# EAGLE design CTD_bluetooth_revA (EAGLE 7.2.0)
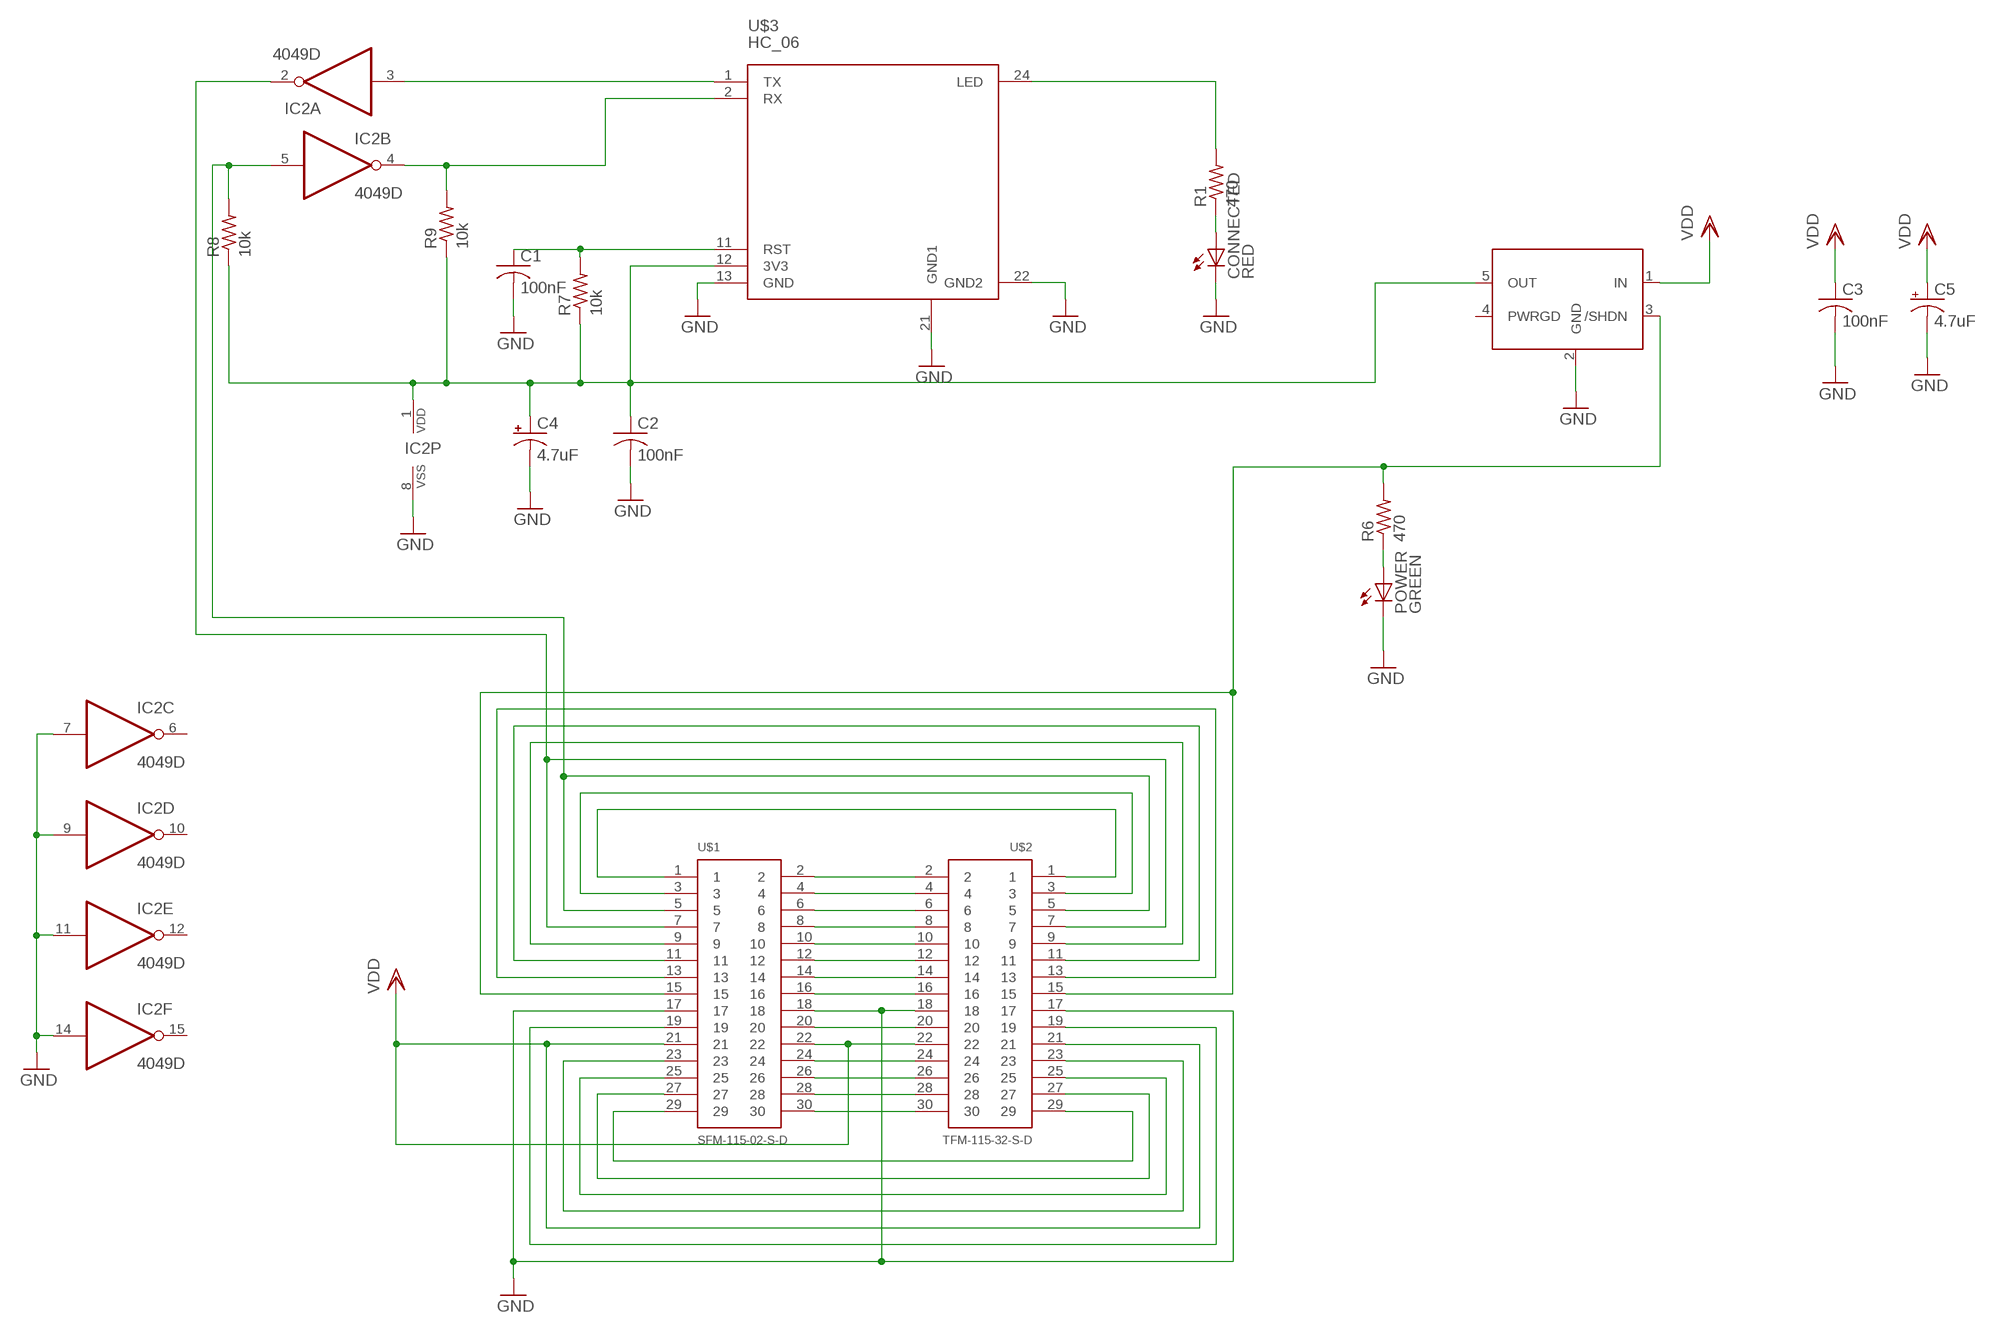
[diagram p0: schematic, sheet 1]

## Parts
C1  100nF  C-US050-024X044  [C050-024X044]
C2  100nF  C-US050-024X044  [C050-024X044]
C3  100nF  C-US050-024X044  [C050-024X044]
C4  4.7uF  CPOL-US153CLV-0505  [153CLV-0505]
C5  4.7uF  CPOL-US153CLV-0505  [153CLV-0505]
CONNECTED  RED  LEDSMT1206  [1206]
IC2  4049D  [SO16]
POWER  GREEN  LEDSMT1206  [1206]
R1  470  R-US_R5025  [R5025]
R6  470  R-US_R5025  [R5025]
R7  10k  R-US_R5025  [R5025]
R8  10k  R-US_R5025  [R5025]
R9  10k  R-US_R5025  [R5025]
U$1  SFM-115-02-S-D  [SFM-115-02-S-D]
U$2  TFM-115-32-S-D  [TFM-115-32-S-D]
U$3  HC_06  [BLUETOOTH_SMD_HC06]
U$4  MCP1755T  [SOT23-5]

## Nets
3V3: C2.1 C4.+ IC2.1(P:VDD) R7.1 R8.1 R9.1 U$3.12(3V3) U$4.5(OUT)
GND: C1.2 C2.2 C3.2 C4.- C5.- CONNECTED.C IC2.7(C:I) IC2.8(P:VSS) IC2.9(D:I) IC2.11(E:I) IC2.14(F:I) POWER.C U$1.17 U$1.18 U$2.17 U$2.18 U$3.13(GND) U$3.21(GND1) U$3.22(GND2) U$4.2(GND)
N$1: U$1.2 U$2.2
N$2: U$1.4 U$2.4
N$3: CONNECTED.A R1.1
N$4: U$1.6 U$2.6
N$5: U$1.10 U$2.10
N$6: U$1.12 U$2.12
N$7: U$1.14 U$2.14
N$8: U$1.8 U$2.8
N$9: U$1.16 U$2.16
N$10: U$1.20 U$2.20
N$11: POWER.A R6.1
N$12: U$1.24 U$2.24
N$13: U$1.26 U$2.26
N$14: U$1.28 U$2.28
N$15: U$1.30 U$2.30
N$16: U$1.1 U$2.1
N$17: U$1.3 U$2.3
N$20: U$1.9 U$2.9
N$21: U$1.11 U$2.11
N$22: U$1.13 U$2.13
N$24: U$1.29 U$2.29
N$25: U$1.27 U$2.27
N$26: U$1.25 U$2.25
N$27: U$1.23 U$2.23
N$29: U$1.19 U$2.19
N$34: R1.2 U$3.24(LED)
N$36: C1.1 R7.2 U$3.11(RST)
RX: IC2.5(B:I) R8.2 U$1.5 U$2.5
RXPRE: IC2.4(B:O) R9.2 U$3.2(RX)
SHUTDOWN: R6.2 U$1.15 U$2.15 U$4.3(/SHDN)
TX: IC2.2(A:O) U$1.7 U$2.7
TXPRE: IC2.3(A:I) U$3.1(TX)
VDD: C3.1 C5.+ U$1.21 U$1.22 U$2.21 U$2.22 U$4.1(IN)
Unconnected: IC2.6(C:O) IC2.10(D:O) IC2.12(E:O) IC2.15(F:O) U$4.4(PWRGD)

## Library data of the parts
C1-C3 = rcl:C-US: CAPACITOR, American symbol
C4 C5 = rcl:CPOL-US: POLARIZED CAPACITOR, American symbol
CONNECTED POWER = led:LED: LED OSRAM: - CHIPLED LG R971, LG N971, LY N971, LG Q971, LY Q971, LO R971, LY R971 LH N974, LH R974 LS Q976, LO Q976, LY Q976 LO Q996 - Hyper CHIPLED LW Q18S LB Q993, LB Q99A, LB R99A - SideLED LS A670, LO A670, LY A670, LG A670, LP A670 LB A673, LV A673, LT A673, LW A673 LH A674 LY A675 LS A676, LA A676, LO A676, LY A676, LW A676 LS A679, LY A679, LG A679 - Hyper Micro SIDELED® LS Y876, LA Y876, LO Y876, LY Y876 LT Y87S - SmartLED LW L88C, LW L88S LB L89C, LB L89S, LG L890 LS L89K, LO L89K, LY L89K LS L896, LA L896, LO L896, LY L896 - TOPLED LS T670, LO T670, LY T670, LG T670, LP T670 LSG T670, LSP T670, LSY T670, LOP T670, LYG T670 LG T671, LOG T671, LSG T671 LB T673, LV T673, LT T673, LW T673 LH T674 LS T676, LA T676, LO T676, LY T676, LB T676, LH T676, LSB T676, LW T676 LB T67C, LV T67C, LT T67C, LS T67K, LO T67K, LY T67K, LW E67C LS E67B, LA E67B, LO E67B, LY E67B, LB E67C, LV E67C, LT E67C LW T67C LS T679, LY T679, LG T679 LS T770, LO T770, LY T770, LG T770, LP T770 LB T773, LV T773, LT T773, LW T773 LH T774 LS E675, LA E675, LY E675, LS T675 LS T776, LA T776, LO T776, LY T776, LB T776 LHGB T686 LT T68C, LB T68C - Hyper Mini TOPLED® LB M676 - Mini TOPLED Santana® LG M470 LS M47K, LO M47K, LY M47K Source: http://www.osram.convergy.de LUXEON: - LUMILED® LXK2-PW12-R00, LXK2-PW12-S00, LXK2-PW14-U00, LXK2-PW14-V00 LXK2-PM12-R00, LXK2-PM12-S00, LXK2-PM14-U00 LXK2-PE12-Q00, LXK2-PE12-R00, LXK2-PE12-S00, LXK2-PE14-T00, LXK2-PE14-U00 LXK2-PB12-K00, LXK2-PB12-L00, LXK2-PB12-M00, LXK2-PB14-N00, LXK2-PB14-P00, LXK2-PB14-Q00 LXK2-PR12-L00, LXK2-PR12-M00, LXK2-PR14-Q00, LXK2-PR14-R00 LXK2-PD12-Q00, LXK2-PD12-R00, LXK2-PD12-S00 LXK2-PH12-R00, LXK2-PH12-S00 LXK2-PL12-P00, LXK2-PL12-Q00, LXK2-PL12-R00 Source: www.luxeon.com KINGBRIGHT: KA-3528ASYC Source: www.kingbright.com
IC2 = 40xx:4049: Hex inverting BUFFER
R1 R6-R9 = resistor:R-US_: RESISTOR, American symbol
U$1 = SFM-115-02-X-DH:SFM-115-02-S-D: SMT & THROUGH-HOLE TIGER EYE™ SOCKET SFM, SFML SERIES
U$2 = TFM-115-32-S-D:TFM-115-32-S-D: TFM, TFML SERIES SMT & THROUGH-HOLE HEADER
U$3 = SerialPortBluetooth:HC_06: HC-06 Bluetooth Module. Slave.
U$4 = microchip-vreg:MCP1755T

## Board
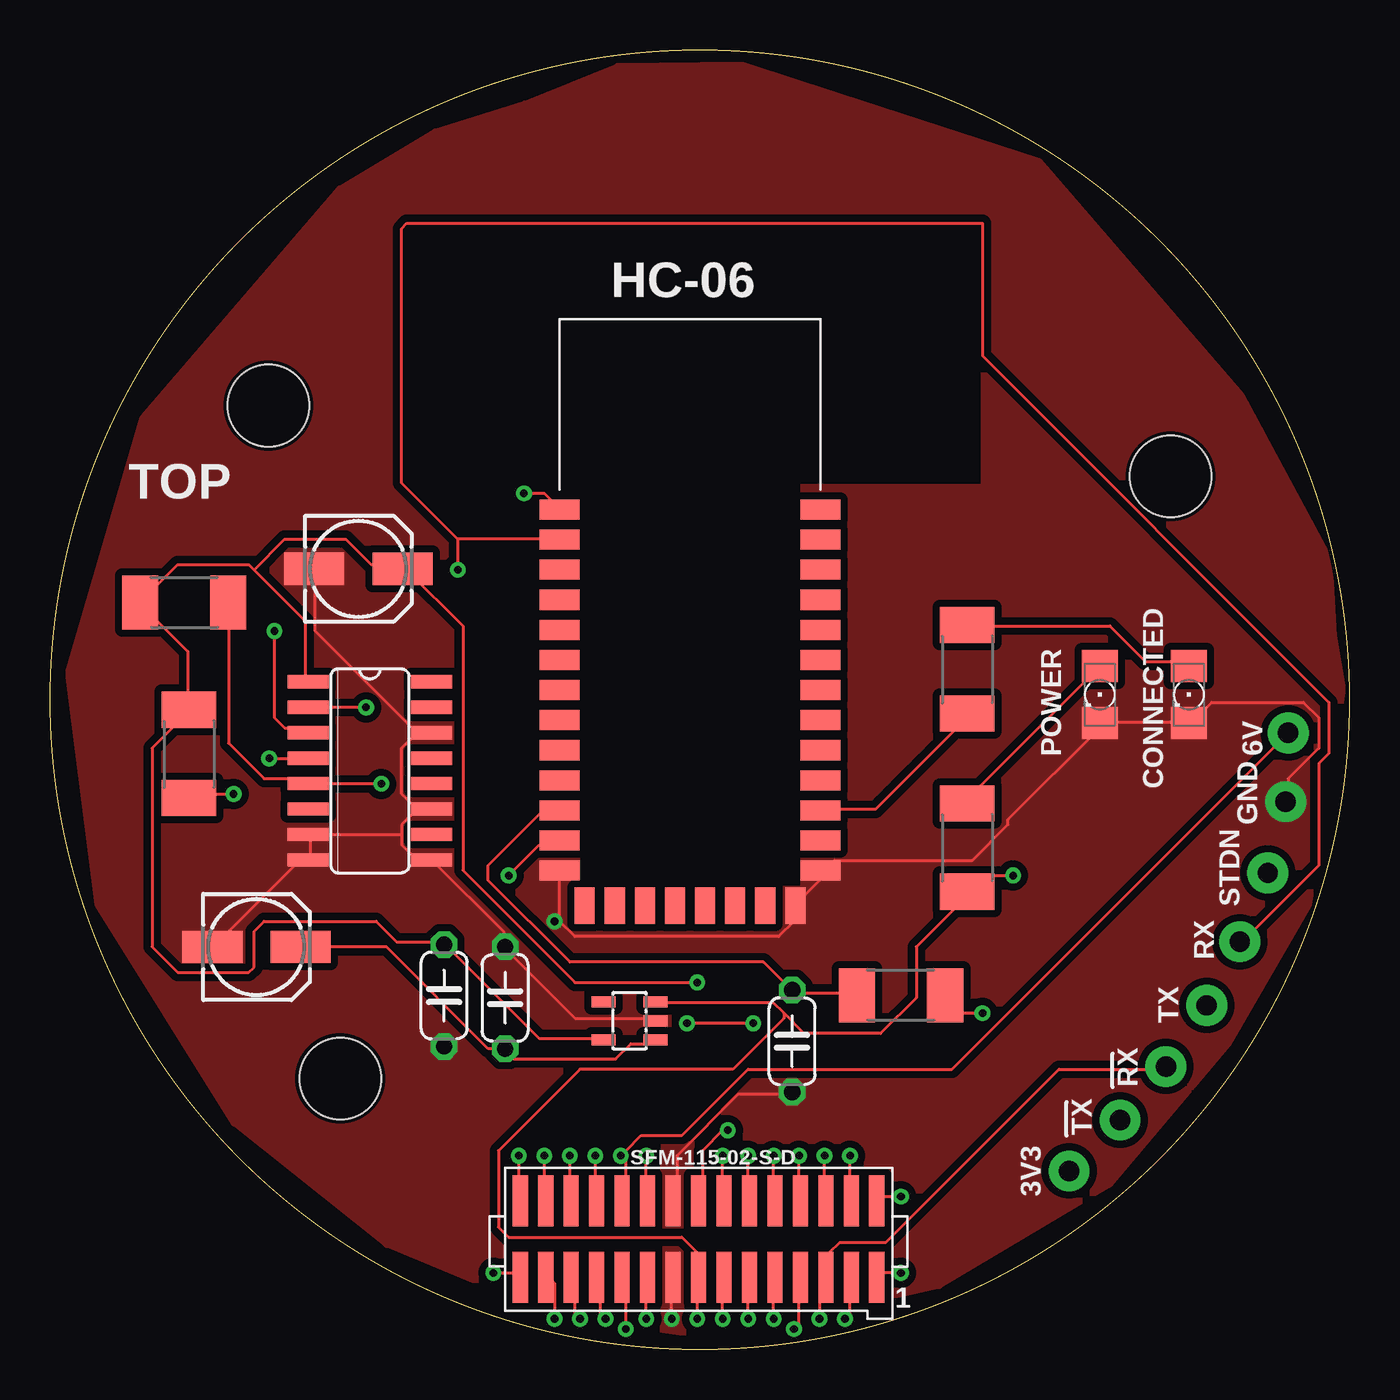
[diagram p1: board, top side]
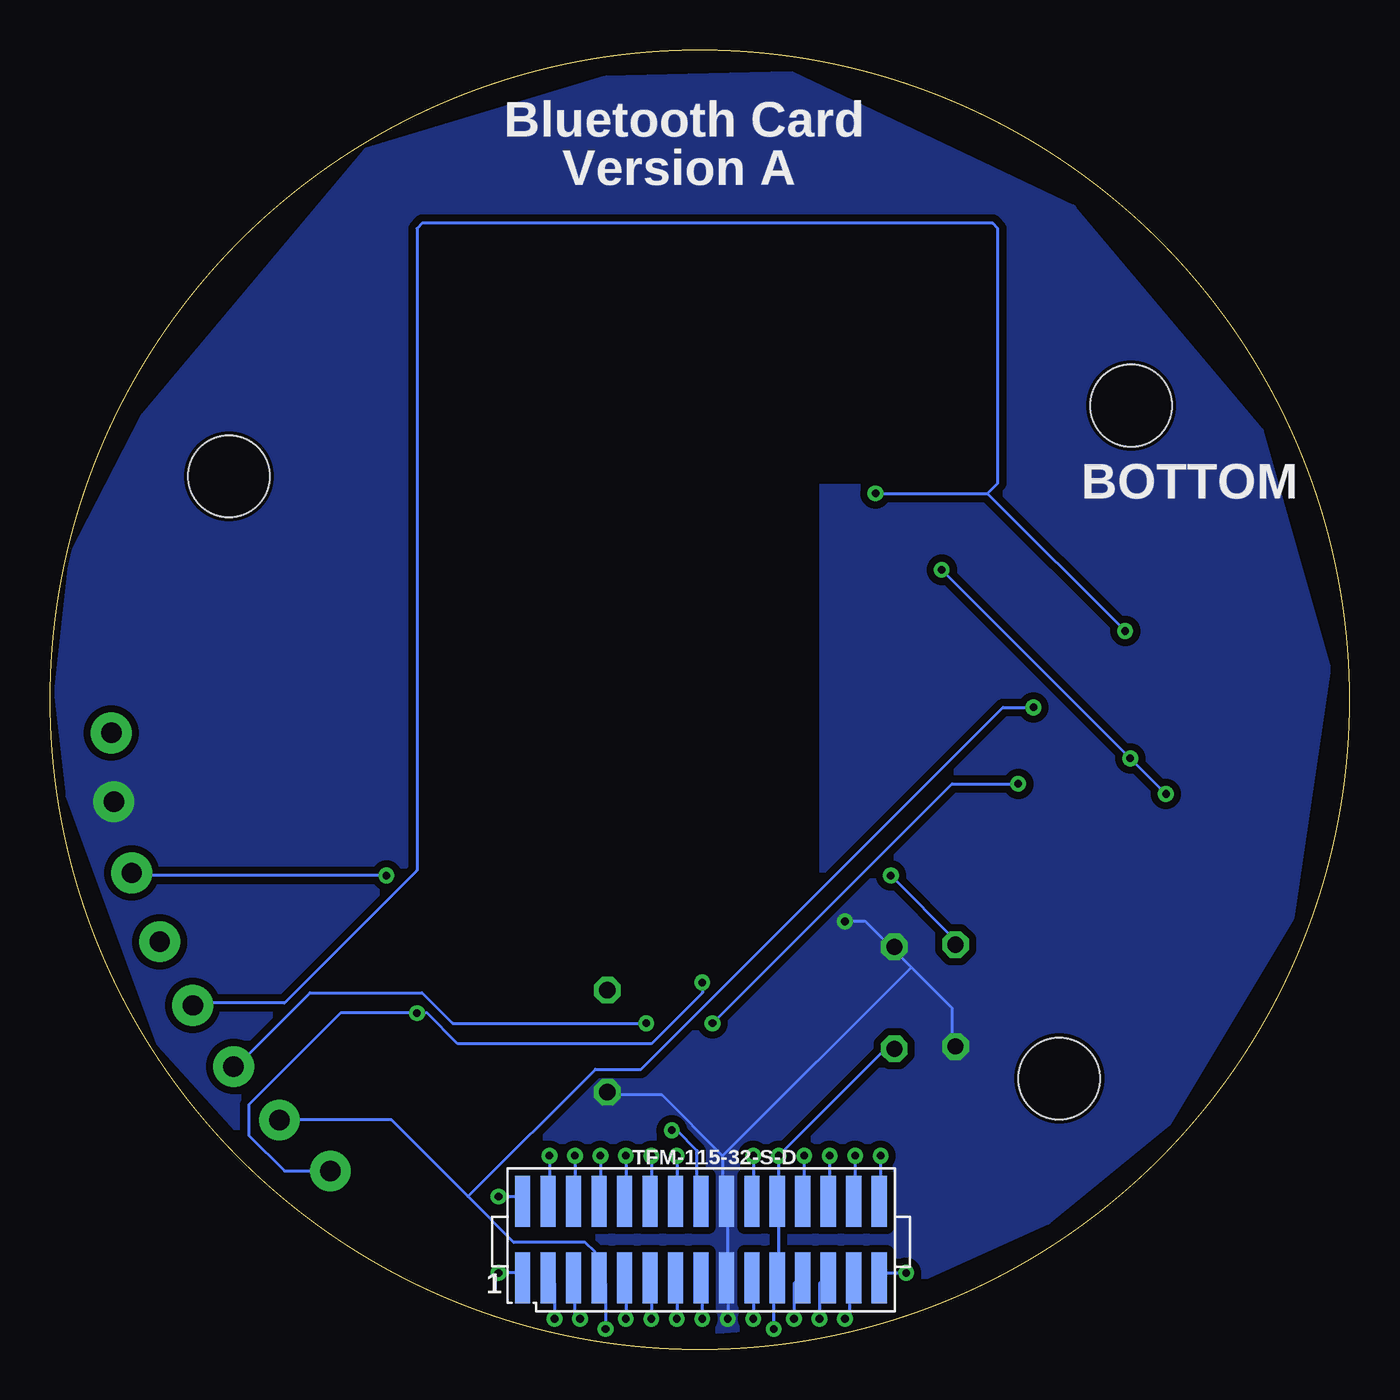
[diagram p2: board, bottom side, seen from below]

Size 64.77 x 64.77 mm. Coordinates in mm from the lower left corner, seen from the top.
Outline: circle at 32.38,32.38 radius 32.38
Copper layers (1*16): Top 0.035mm / dielectric 1.5mm / Bottom 0.035mm
Design rules "default *": minimum track width 6mil, minimum drill 15mil, track to track 14mil, track to pad 14mil, pad to pad 14mil, via to via 10mil, smd to smd 14mil, copper to edge 8mil, drill to drill 8mil, minimum pad ring 10mil, minimum via ring 8mil, stop-mask expansion 4mil, vias tented up to drill 0mil, thermal gap 10mil
Holes 4.06 mm at 55.86,43.53 14.46,13.51 10.88,47.05
tRestrict: area 26.4,23.1 to 37.4,51.4; area 17.8,43.2 to 46.4,55.9
bRestrict: area 26.4,23.1 to 37.4,51.4; area 17.8,43.2 to 46.4,55.9

### Footprints (pad centres in the part's own frame; a part is rotated, then mirrored left to right if it is on the bottom)
C050-024X044 = drill 0.813 octagon: 1 -2.54,0; 2 2.54,0
153CLV-0505 = smd 3 x 1.6: + 2.2,0; - -2.2,0
1206 = smd 1.6 x 1.803: A -1.422,0; C 1.422,0
SO16 = smd 0.66 x 2.032: 1 -4.445,-3.073; 2 -3.175,-3.073; 3 -1.905,-3.073; 4 -0.635,-3.073; 5 0.635,-3.073; 6 1.905,-3.073; 7 3.175,-3.073; 8 4.445,-3.073; 9 4.445,3.073; 10 3.175,3.073; 11 1.905,3.073; 12 0.635,3.073; 13 -0.635,3.073; 14 -1.905,3.073; 15 -3.175,3.073; 16 -4.445,3.073
R5025 = smd 1.8 x 2.7: 1 -2.2,0; 2 2.2,0
SFM-115-02-S-D = smd 0.762 x 2.54: 1 0,2.54; 2 0,-1.27; 3 1.27,2.54; 4 1.27,-1.27; 5 2.54,2.54; 6 2.54,-1.27; 7 3.81,2.54; 8 3.81,-1.27; 9 5.08,2.54; 10 5.08,-1.27; 11 6.35,2.54; 12 6.35,-1.27; 13 7.62,2.54; 14 7.62,-1.27; 15 8.89,2.54; 16 8.89,-1.27; 17 10.16,2.54; 18 10.16,-1.27; 19 11.43,2.54; 20 11.43,-1.27; 21 12.7,2.54; 22 12.7,-1.27; 23 13.97,2.54; 24 13.97,-1.27; 25 15.24,2.54; 26 15.24,-1.27; 27 16.51,2.54; 28 16.51,-1.27; 29 17.78,2.54; 30 17.78,-1.27
TFM-115-32-S-D = smd 0.762 x 2.54: 1 19.05,8.89; 2 19.05,5.08; 3 17.78,8.89; 4 17.78,5.08; 5 16.51,8.89; 6 16.51,5.08; 7 15.24,8.89; 8 15.24,5.08; 9 13.97,8.89; 10 13.97,5.08; 11 12.7,8.89; 12 12.7,5.08; 13 11.43,8.89; 14 11.43,5.08; 15 10.16,8.89; 16 10.16,5.08; 17 8.89,8.89; 18 8.89,5.08; 19 7.62,8.89; 20 7.62,5.08; 21 6.35,8.89; 22 6.35,5.08; 23 5.08,8.89; 24 5.08,5.08; 25 3.81,8.89; 26 3.81,5.08; 27 2.54,8.89; 28 2.54,5.08; 29 1.27,8.89; 30 1.27,5.08
BLUETOOTH_SMD_HC06 = smd 2 x 1: 1 2.54,21.59; 2 2.54,20.09; 3 2.54,18.59; 4 2.54,17.09; 5 2.54,15.59; 6 2.54,14.09; 7 2.54,12.59; 8 2.54,11.09; 9 2.54,9.59; 10 2.54,8.09; 11 2.54,6.59; 12 2.54,5.09; 13 2.54,3.59; 22 15.54,3.59; 23 15.54,5.09; 24 15.54,6.59; 25 15.54,8.09; 26 15.54,9.59; 27 15.54,11.09; 28 15.54,12.59; 29 15.54,14.09; 30 15.54,15.59; 31 15.54,17.09; 32 15.54,18.59; 33 15.54,20.09; 34 15.54,21.59 | smd 1 x 1.8: 14 3.79,1.84; 15 5.29,1.84; 16 6.79,1.84; 17 8.29,1.84; 18 9.79,1.84; 19 11.29,1.84; 20 12.79,1.84; 21 14.29,1.84
SOT23-5 = smd 0.55 x 1.2: 1 -0.95,-1.3; 2 0,-1.3; 3 0.95,-1.3; 4 0.95,1.3; 5 -0.95,1.3

### Placement (x,y rotation side)
C1  36.99,15.36 270 top
C2  19.64,17.64 270 top
C3  22.68,17.52 90 top
C4  15.37,38.91 0 top
C5  10.29,20.07 0 top
CONNECTED  56.77,32.64 270 top
IC2  15.94,28.84 270 top
POWER  52.32,32.64 270 top
R1  45.72,33.91 270 top
R6  45.72,25.02 270 top
R7  42.42,17.65 180 top
R8  6.68,37.24 0 top
R9  6.92,29.68 270 top
U$1  41.21,6.13 180 top
U$2  22.17,12.46 180 bottom
U$3  22.86,20.28 0 top
U$4  28.88,16.38 90 top

### Tracks (layer width: path | path; a pad name or v marks a point on that pad's centre or on a via)
3V3  (via drill 0.38, 1.02 pad 2.03)
  Top 0.152: v46.48,16.76 45.47,16.76 44.7,17.53 R7.1 | U$4.5 27.43,15.49 24.38,15.49 19.81,20.07 C2.1 19.56,20.32 17.27,20.32 16.26,21.34 10.67,21.34 10.16,20.83 10.16,19.05 9.91,18.8 6.35,18.8 5.08,20.07 5.08,29.97 6.86,31.75 R9.1 6.86,32 6.86,34.8 4.57,37.08 R8.1 4.57,37.34 6.35,39.12 9.91,39.12 10.16,38.86 | v22.86,23.62 24.38,25.15 25.4,25.15 U$3.12 | 10.16,38.86 12.7,36.32 12.7,33.53 IC2.1 | 10.16,38.86 11.68,40.39 14.73,40.39 16,39.12 17.53,39.12 C4.+ 17.78,38.86 20.57,36.07 20.57,23.88 26.16,18.29 v32.26,18.29
  Bottom 0.152: v50.8,8.89 53.09,8.89 54.86,10.67 54.86,12.19 50.29,16.76 v46.48,16.76 45.97,16.76 44.45,15.24 34.8,15.24 32.26,17.78 v32.26,18.29 | v22.86,23.62 19.56,20.32 C2.1
GND  (via drill 0.38, 1.02 pad 2.03)
  Top 0.152: v61.59,27.3 61.72,27.43 61.72,28.45 63.25,29.97 63.25,31.5 62.48,32.26 57.91,32.26 56.9,31.24 CONNECTED.C 56.64,31.24 52.32,31.24 POWER.C 52.32,30.99 47.75,26.42 47.75,26.16 45.97,24.38 39.12,24.38 38.61,23.88 U$3.22 38.61,23.62 37.34,22.35 U$3.21 37.08,22.1 37.08,21.34 36.32,20.57 26.16,20.57 25.4,21.34 | 25.4,21.34 U$3.13 | v30.99,1.52 30.99,3.56 U$1.17 | U$1.18 31.24,7.62 31.24,9.65 34.29,12.7 36.83,12.7 C1.2 | U$4.2 29.97,16.51 26.16,16.51 22.86,19.81 C3.2 22.61,20.07 22.61,20.83 19.05,24.38 IC2.9 18.8,24.64 18.03,24.64 17.53,25.15 17.53,25.65 | 12.95,25.65 12.95,24.64 IC2.8 12.7,24.64 8.13,20.07 C5.- | 17.53,25.65 17.53,26.16 18.29,26.92 | 18.29,26.92 18.8,26.92 IC2.11 18.29,26.92 | 18.29,30.73 18.8,30.73 IC2.14 18.29,30.73 | 18.29,30.73 17.53,29.97 17.53,27.69 18.29,26.92 | 17.53,25.65 12.95,25.65 | 12.95,25.65 IC2.7 | 18.29,30.73 13.21,35.81 13.21,38.86 C4.- | v25.15,21.34 25.4,21.34
  Bottom 0.152: v30.99,1.52 30.99,3.56 U$2.17 30.99,3.81 30.99,7.37 U$2.18 31.24,7.62 31.24,9.65 | 31.24,9.65 34.29,12.7 36.83,12.7 C1.2 | 21.84,19.05 22.61,19.81 C3.2 22.86,20.07 24.13,21.34 v25.15,21.34 | 21.84,19.05 19.81,17.02 19.81,15.24 C2.2 | 21.84,19.05 31.24,9.65
  pour Top (no thermals): 19.2,60.66 23.65,62.05 28.32,63.95 34.46,64.02 49.27,59.2 59.35,47.52 63.58,39.64 63.8,38.25 63.95,35.55 64.39,32.92 62.71,22.19 58.69,15.26 52.78,8.25 44.31,3.21 33,0.66 25.26,1.75 16.79,5.26 9.2,11.31 2.41,22.19 0.95,33.73 4.67,46.43 14.45,57.82
  pour Bottom (no thermals): 63.66,39.57 64.39,32.78 63.8,27.59 59.28,15.26 53,8.32 44.31,3.21 33.87,0.8 26.21,1.39 15.04,6.42 9.05,11.31 2.92,21.54 1.09,33.95 4.45,45.77 13.8,56.87 27.81,63.51 37.08,63.29 48.98,59.71 60.08,46.5
N$1  (via drill 0.38)
  Top 0.152: v42.42,7.62 41.4,7.62 U$1.2
  Bottom 0.152: v42.42,7.62 41.4,7.62 U$2.2
N$2  (via drill 0.38)
  Top 0.152: v39.88,9.65 39.88,7.62 U$1.4
  Bottom 0.152: v39.88,9.65 39.88,7.62 U$2.4
N$3
  Top 0.152: CONNECTED.A 56.64,34.29 54.61,34.29 52.83,36.07 45.72,36.07 R1.1
N$4  (via drill 0.38)
  Top 0.152: v38.61,9.65 38.61,7.62 U$1.6
  Bottom 0.152: v38.61,9.65 38.61,7.62 U$2.6
N$5  (via drill 0.38)
  Top 0.152: v36.07,9.65 36.07,7.62 U$1.10
  Bottom 0.152: v36.07,9.65 36.07,7.62 U$2.10
N$6  (via drill 0.38)
  Top 0.152: v34.8,9.65 34.8,7.62 U$1.12
  Bottom 0.152: v34.8,9.65 34.8,7.62 U$2.12
N$7  (via drill 0.38)
  Top 0.152: v33.53,9.65 33.53,7.62 U$1.14
  Bottom 0.152: v33.53,9.65 33.53,7.62 U$2.14
N$8  (via drill 0.38)
  Top 0.152: v37.34,9.65 37.34,7.62 U$1.8
  Bottom 0.152: v37.34,9.65 37.34,7.62 U$2.8
N$9  (via drill 0.38)
  Top 0.152: v33.78,10.92 33.53,10.92 32.51,9.91 32.51,7.62 U$1.16
  Bottom 0.152: v33.78,10.92 33.53,10.92 32.51,9.91 32.51,7.62 U$2.16
N$10  (via drill 0.38)
  Top 0.152: v29.72,9.65 29.72,7.62 U$1.20
  Bottom 0.152: v29.72,9.65 29.72,7.62 U$2.20
N$11
  Top 0.152: POWER.A 52.32,34.04 45.72,27.43 R6.1
N$12  (via drill 0.38)
  Top 0.152: v27.18,9.65 27.18,7.62 U$1.24
  Bottom 0.152: v27.18,9.65 27.18,7.62 U$2.24
N$13  (via drill 0.38)
  Top 0.152: v25.91,9.65 25.91,7.62 U$1.26
  Bottom 0.152: v25.91,9.65 25.91,7.62 U$2.26
N$14  (via drill 0.38)
  Top 0.152: v24.64,9.65 24.64,7.62 U$1.28
  Bottom 0.152: v24.64,9.65 24.64,7.62 U$2.28
N$15  (via drill 0.38)
  Top 0.152: v23.37,9.65 23.37,7.62 U$1.30
  Bottom 0.152: v23.37,9.65 23.37,7.62 U$2.30
N$16  (via drill 0.38)
  Top 0.152: v42.42,3.81 41.4,3.81 U$1.1
  Bottom 0.152: v42.42,3.81 41.4,3.81 U$2.1
N$17  (via drill 0.38)
  Top 0.152: v39.62,1.52 39.88,1.78 39.88,3.56 U$1.3
  Bottom 0.152: v39.62,1.52 39.62,3.3 39.88,3.56 U$2.3
N$20  (via drill 0.38)
  Top 0.152: v36.07,1.52 36.07,3.56 U$1.9
  Bottom 0.152: v36.07,1.52 36.07,3.56 U$2.9
N$21  (via drill 0.38)
  Top 0.152: v34.8,1.52 34.8,3.56 U$1.11
  Bottom 0.152: v34.8,1.52 34.8,3.56 U$2.11
N$22  (via drill 0.38)
  Top 0.152: v33.53,1.52 33.53,3.56 U$1.13
  Bottom 0.152: v33.53,1.52 33.53,3.56 U$2.13
N$24  (via drill 0.38)
  Top 0.152: v22.1,3.81 23.37,3.81 U$1.29
  Bottom 0.152: v22.1,3.81 23.37,3.81 U$2.29
N$25  (via drill 0.38)
  Top 0.152: v25.15,1.52 25.15,3.3 24.89,3.56 U$1.27
  Bottom 0.152: v25.15,1.52 24.89,1.78 24.89,3.56 U$2.27
N$26  (via drill 0.38)
  Top 0.152: v26.42,1.52 26.16,1.78 26.16,3.56 U$1.25
  Bottom 0.152: v26.42,1.52 26.42,3.3 26.16,3.56 U$2.25
N$27  (via drill 0.38)
  Top 0.152: v27.69,1.52 27.43,1.78 27.43,3.56 U$1.23
  Bottom 0.152: v27.69,1.52 27.69,3.3 27.43,3.56 U$2.23
N$29  (via drill 0.38)
  Top 0.152: v29.72,1.52 29.72,3.56 U$1.19
  Bottom 0.152: v29.72,1.52 29.72,3.56 U$2.19
N$34
  Top 0.152: U$3.24 38.61,26.92 41.15,26.92 45.72,31.5 R1.2
N$36
  Top 0.152: U$3.11 25.4,26.67 24.38,26.67 21.84,24.13 21.84,23.37 25.91,19.3 35.56,19.3 36.83,18.03 C1.1 37.08,17.78 40.13,17.78 R7.2
RX  (via drill 0.38, 1.02 pad 2.03)
  Top 0.152: R8.2 8.89,37.08 8.89,30.23 10.67,28.45 12.7,28.45 IC2.5 12.95,28.19 v16.51,28.19 | v55.63,14.1 55.63,13.97 50.29,13.97 41.66,5.33 39.37,5.33 38.86,4.83 38.86,3.81 U$1.5 38.61,3.56 38.35,3.3 v38.35,1.52 | v35.05,16.26 v31.75,16.26
  Bottom 0.152: v38.35,1.52 38.61,1.78 38.61,3.56 U$2.5 | v16.51,28.19 19.81,28.19 v31.75,16.26 | v35.05,16.26 44.7,16.26 46.23,17.78 51.82,17.78 55.63,13.97 v55.63,14.1
RXPRE  (via drill 0.38, 1.02 pad 2.03)
  Top 0.152: v10.92,29.46 12.7,29.46 IC2.4 | v9.14,27.69 7.11,27.69 R9.2 | 20.32,40.39 17.53,43.18 17.53,55.88 17.78,56.13 46.48,56.13 46.48,49.53 63.75,32.26 63.75,29.72 63.25,29.21 63.25,24.13 59.44,20.32 v59.31,20.32 | 20.32,40.39 25.4,40.39 U$3.2 | 20.32,40.39 v20.32,38.86
  Bottom 0.152: v9.14,27.69 v10.92,29.46 v20.32,38.86
SHUTDOWN  (via drill 0.38, 1.02 pad 2.03)
  Top 0.152: v32.26,1.52 32.26,3.56 U$1.15 32.26,3.81 32.26,4.83 31.5,5.59 22.86,5.59 22.35,6.1 22.35,9.91 26.42,13.97 34.04,13.97 36.58,16.51 36.58,16.76 | 36.58,16.76 37.59,15.75 41.4,15.75 43.18,17.53 43.18,20.07 45.72,22.61 R6.2 45.72,22.86 46.48,23.62 v48.01,23.62 | 36.58,16.76 36.07,17.27 30.23,17.27 U$4.3
  Bottom 0.152: v32.26,1.52 32.26,3.56 U$2.15 | v48.01,23.62 60.71,23.62 v60.71,23.75
TX  (via drill 0.38, 1.02 pad 2.03)
  Top 0.152: v15.75,32 12.95,32 IC2.2 | v37.08,1.02 37.34,1.27 37.34,3.56 U$1.7
  Bottom 0.152: v53.34,11.43 47.75,11.43 43.94,7.62 | 43.94,7.62 41.66,5.33 38.1,5.33 37.59,4.83 37.59,3.81 U$2.7 37.34,3.56 37.08,3.3 v37.08,1.02 | v15.75,32 17.27,32 35.31,13.97 37.59,13.97 43.94,7.62
TXPRE  (via drill 0.38, 1.02 pad 2.03)
  Top 0.152: v23.62,42.67 24.64,42.67 25.4,41.91 U$3.1 | v11.18,35.81 11.18,31.5 11.68,30.99 12.7,30.99 IC2.3
  Bottom 0.152: 18.03,42.67 17.53,43.18 17.53,55.88 17.78,56.13 46.23,56.13 46.48,55.88 46.48,23.88 53.09,17.27 57.66,17.27 v57.66,17.14 | v23.62,42.67 18.03,42.67 | 18.03,42.67 v11.18,35.81
VDD  (via drill 0.38, 1.02 pad 2.03)
  Top 0.152: v28.7,1.02 28.7,3.56 U$1.21 | U$4.1 29.97,15.24 28.96,15.24 28.19,14.48 23.11,14.48 22.86,14.73 C3.1 22.61,14.99 21.84,14.99 16.76,20.07 C5.+ | v61.72,30.73 44.96,13.97 34.8,13.97 31.5,10.67 29.46,10.67 28.7,9.91 28.7,9.65 | 28.7,9.65 28.7,7.62 U$1.22 | 28.7,9.65 v28.45,9.65
  Bottom 0.152: v28.7,1.02 28.7,3.56 U$2.21 28.45,3.81 28.45,7.37 U$2.22 28.45,7.62 v28.45,9.65 23.37,14.73 22.86,14.73 C3.1

### Text on the board
tPlace: HC-06 | TOP | 6V | GND | STDN | RX | TX | RX | TX | 3V3
bPlace: Bluetooth Card | Version A | BOTTOM